# EAGLE design eCog114_USB-Serial (EAGLE 6.6.0)
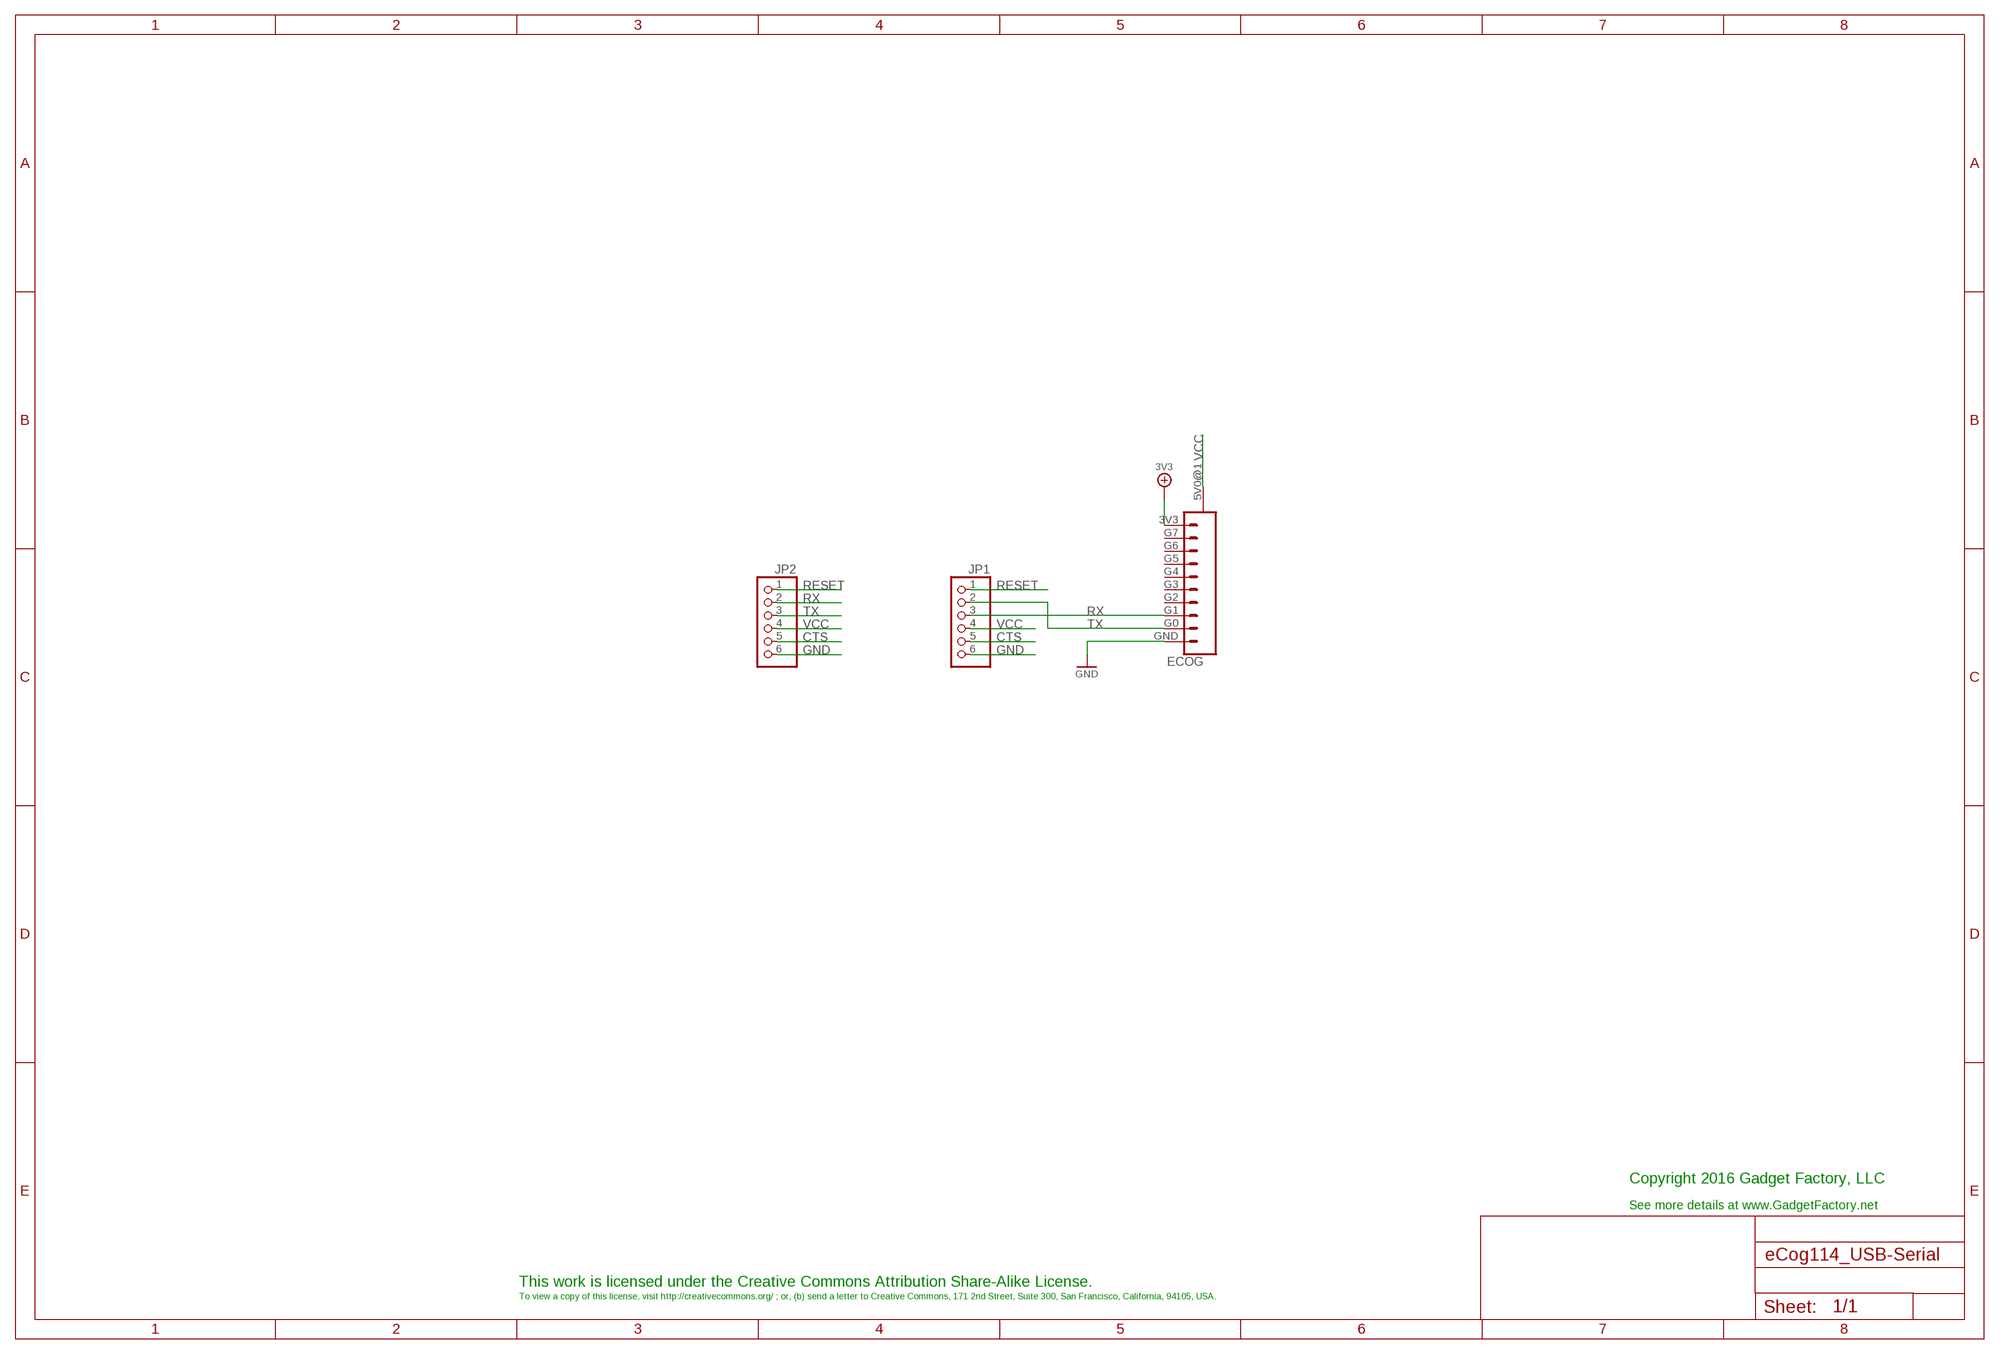
[diagram p0: schematic, sheet 1]

## Parts
ECOG  ECOG_GENERAL_ROWECOG_GENERAL_SMD_ALT1  [ECOG_GENERAL_SMD_ALT]
JP1  PINHD-1X6  [1X06]
JP2  PINHD-1X6  [1X06]

## Nets
3V3: ECOG.3V3
CTS: JP1.5 JP2.5
GND: ECOG.GND JP1.6 JP2.6
RESET: JP1.1 JP2.1
RX: ECOG.G1 JP1.3 JP2.2
TX: ECOG.G0 JP1.2 JP2.3
VCC: ECOG.5V0@1(5V0) JP1.4 JP2.4
Unconnected: ECOG.G2 ECOG.G3 ECOG.G4 ECOG.G5 ECOG.G6 ECOG.G7

## Notes on the sheet
- Copyright 2016 Gadget Factory, LLC
- See more details at www.GadgetFactory.net
- This work is licensed under the Creative Commons Attribution Share-Alike License.
- To view a copy of this license, visit http://creativecommons.org/ ; or, (b) send a letter to Creative Commons, 171 2nd Street, Suite 300, San Francisco, California, 94105, USA.

## Library data of the parts
ECOG = eCogs:ECOG_GENERAL_ROW
JP1 JP2 = pinhead:PINHD-1X6: PIN HEADER

## Board
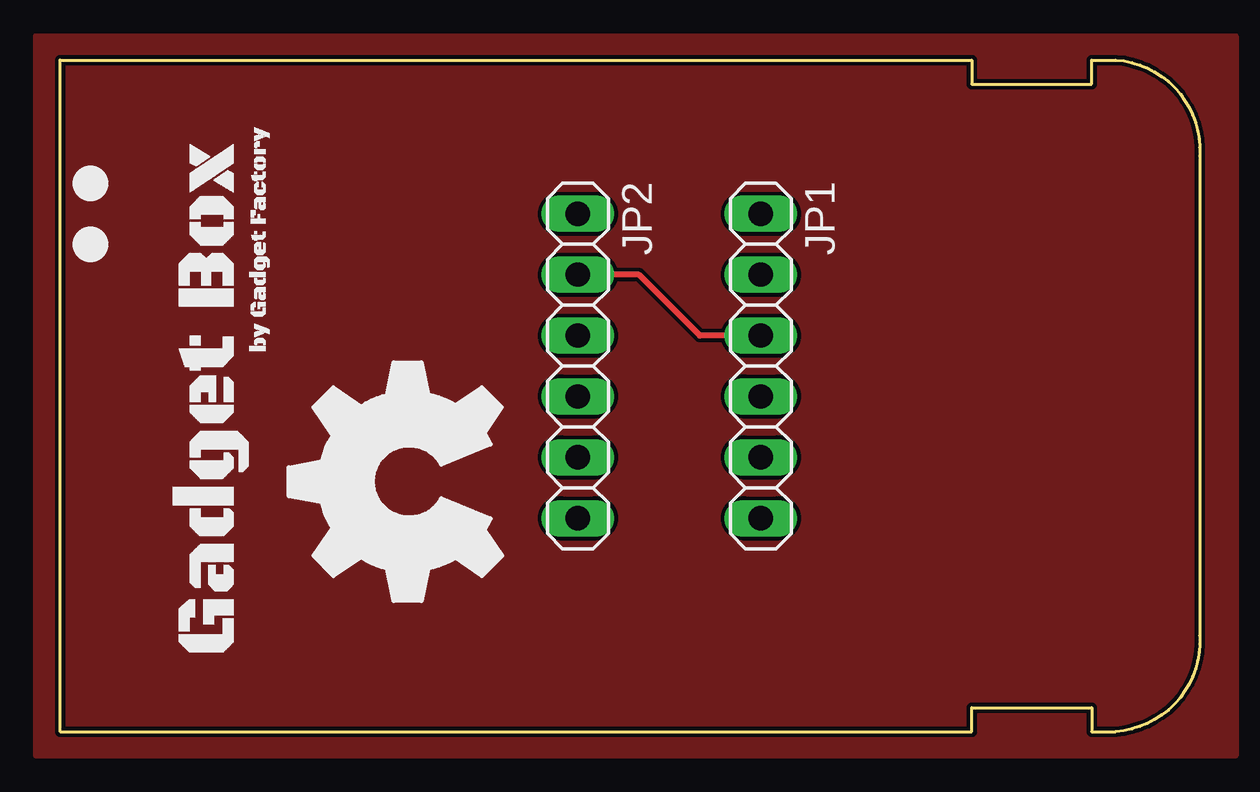
[diagram p1: board, top side]
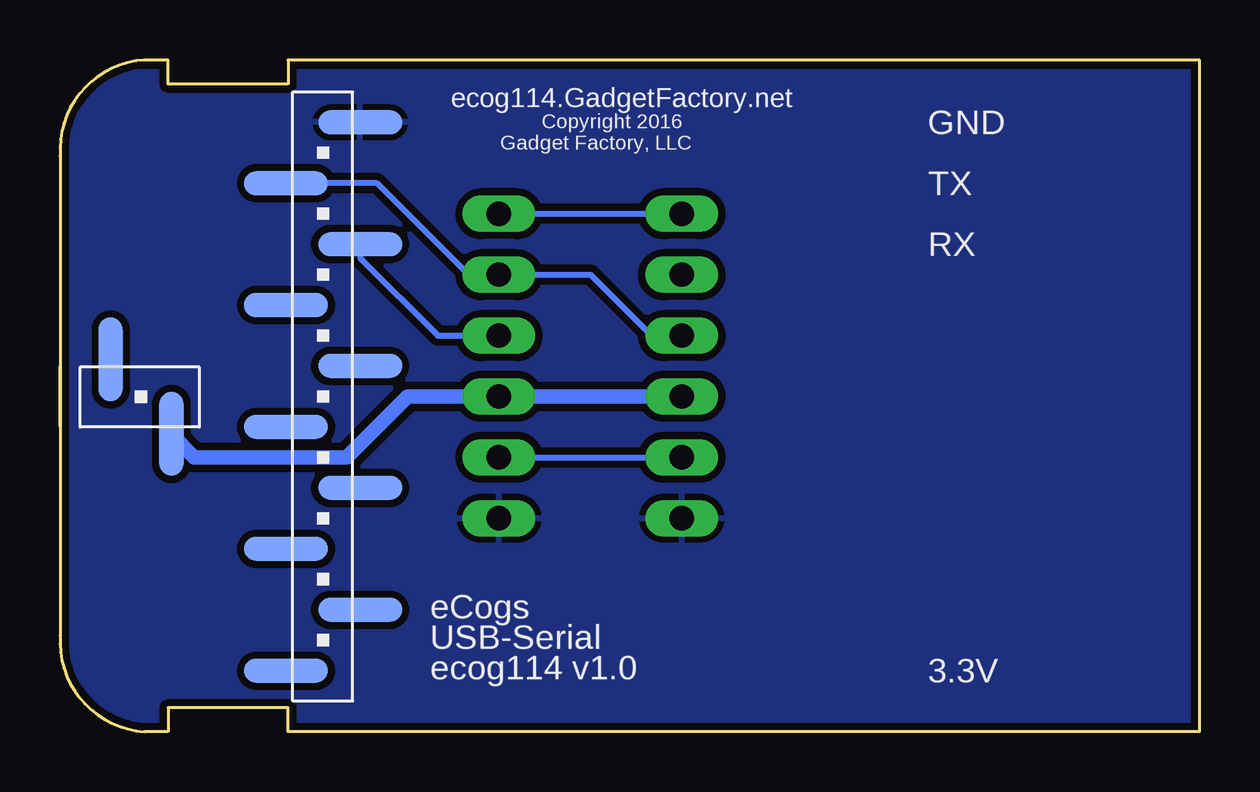
[diagram p2: board, bottom side, seen from below]

Size 47.51 x 28 mm. Coordinates in mm from the lower left corner, seen from the top.
Copper layers (1*16): Top 0.035mm / dielectric 1.5mm / Bottom 0.035mm
Design rules "hackvana *": minimum track width 6mil, minimum drill 0.3mm, track to track 6mil, track to pad 6mil, pad to pad 6mil, via to via 6mil, smd to smd 0mil, copper to edge 6mil, drill to drill 6mil, minimum pad ring 10mil, minimum via ring 6mil, stop-mask expansion 2mil, vias tented up to drill 100mil, thermal gap 10mil

### Footprints (pad centres in the part's own frame; a part is rotated, then mirrored left to right if it is on the bottom)
ECOG_GENERAL_SMD_ALT = smd 3.5 x 1 bottom: 3V3 38.088,2.541; G0 38.088,22.861; G1 34.989,20.321; G2 38.088,17.781; G3 34.989,15.241; G4 38.088,12.701; G5 34.989,10.161; G6 38.088,7.621; G7 34.989,5.081; GND 34.989,25.401 | smd 1 x 3.5 bottom: 5V0@1 42.861,12.412; STABILIZER@2 45.401,15.511
1X06 = drill 1.016 long: 1 -6.35,0; 2 -3.81,0; 3 -1.27,0; 4 1.27,0; 5 3.81,0; 6 6.35,0

### Placement (x,y rotation side)
ECOG  0,0 0 top
JP1  29.21,15.24 270 top
JP2  21.59,15.24 270 top
U$1  [GADGETBOX_SMALL]  6.35,13.97 90 top
U$2  [LEGEND_DIO]  1.27,22.86 0 top
U$3  [LEGEND_DIO]  1.27,20.32 0 top
U$4  [OSHW_FILLX350_NOTEXT]  18.41,5.46 90 top

### Tracks (layer width: path | path; a pad name or v marks a point on that pad's centre or on a via)
3V3
  pour Top: -1,29 49,29 49,-1 -1,-1
CTS
  Bottom 0.254: JP1.5 JP2.5
GND
  pour Bottom (isolate 0.305): -2,30 50,30 50,-2 -2,-2
RESET
  Bottom 0.254: JP1.1 JP2.1
RX
  Top 0.254: JP1.3 26.67,16.51 24.13,19.05 JP2.2
  Bottom 0.254: ECOG.G1 34.99,19.75 31.75,16.51 JP1.3
TX
  Bottom 0.254: ECOG.G0 34.29,22.86 30.48,19.05 JP1.2 25.4,19.05 22.86,16.51 JP2.3
VCC
  Bottom 0.61: ECOG.5V0@1 42.86,12.38 41.91,11.43 35.56,11.43 33.02,13.97 JP1.4 JP2.4

### Text on the board
bPlace: ecog114.GadgetFactory.net | GND | Copyright 2016 | Gadget Factory, LLC | TX | RX | eCogs | USB-Serial | 3.3V | ecog114 v1.0